# EAGLE design Quadcopter (EAGLE 9.5.2)
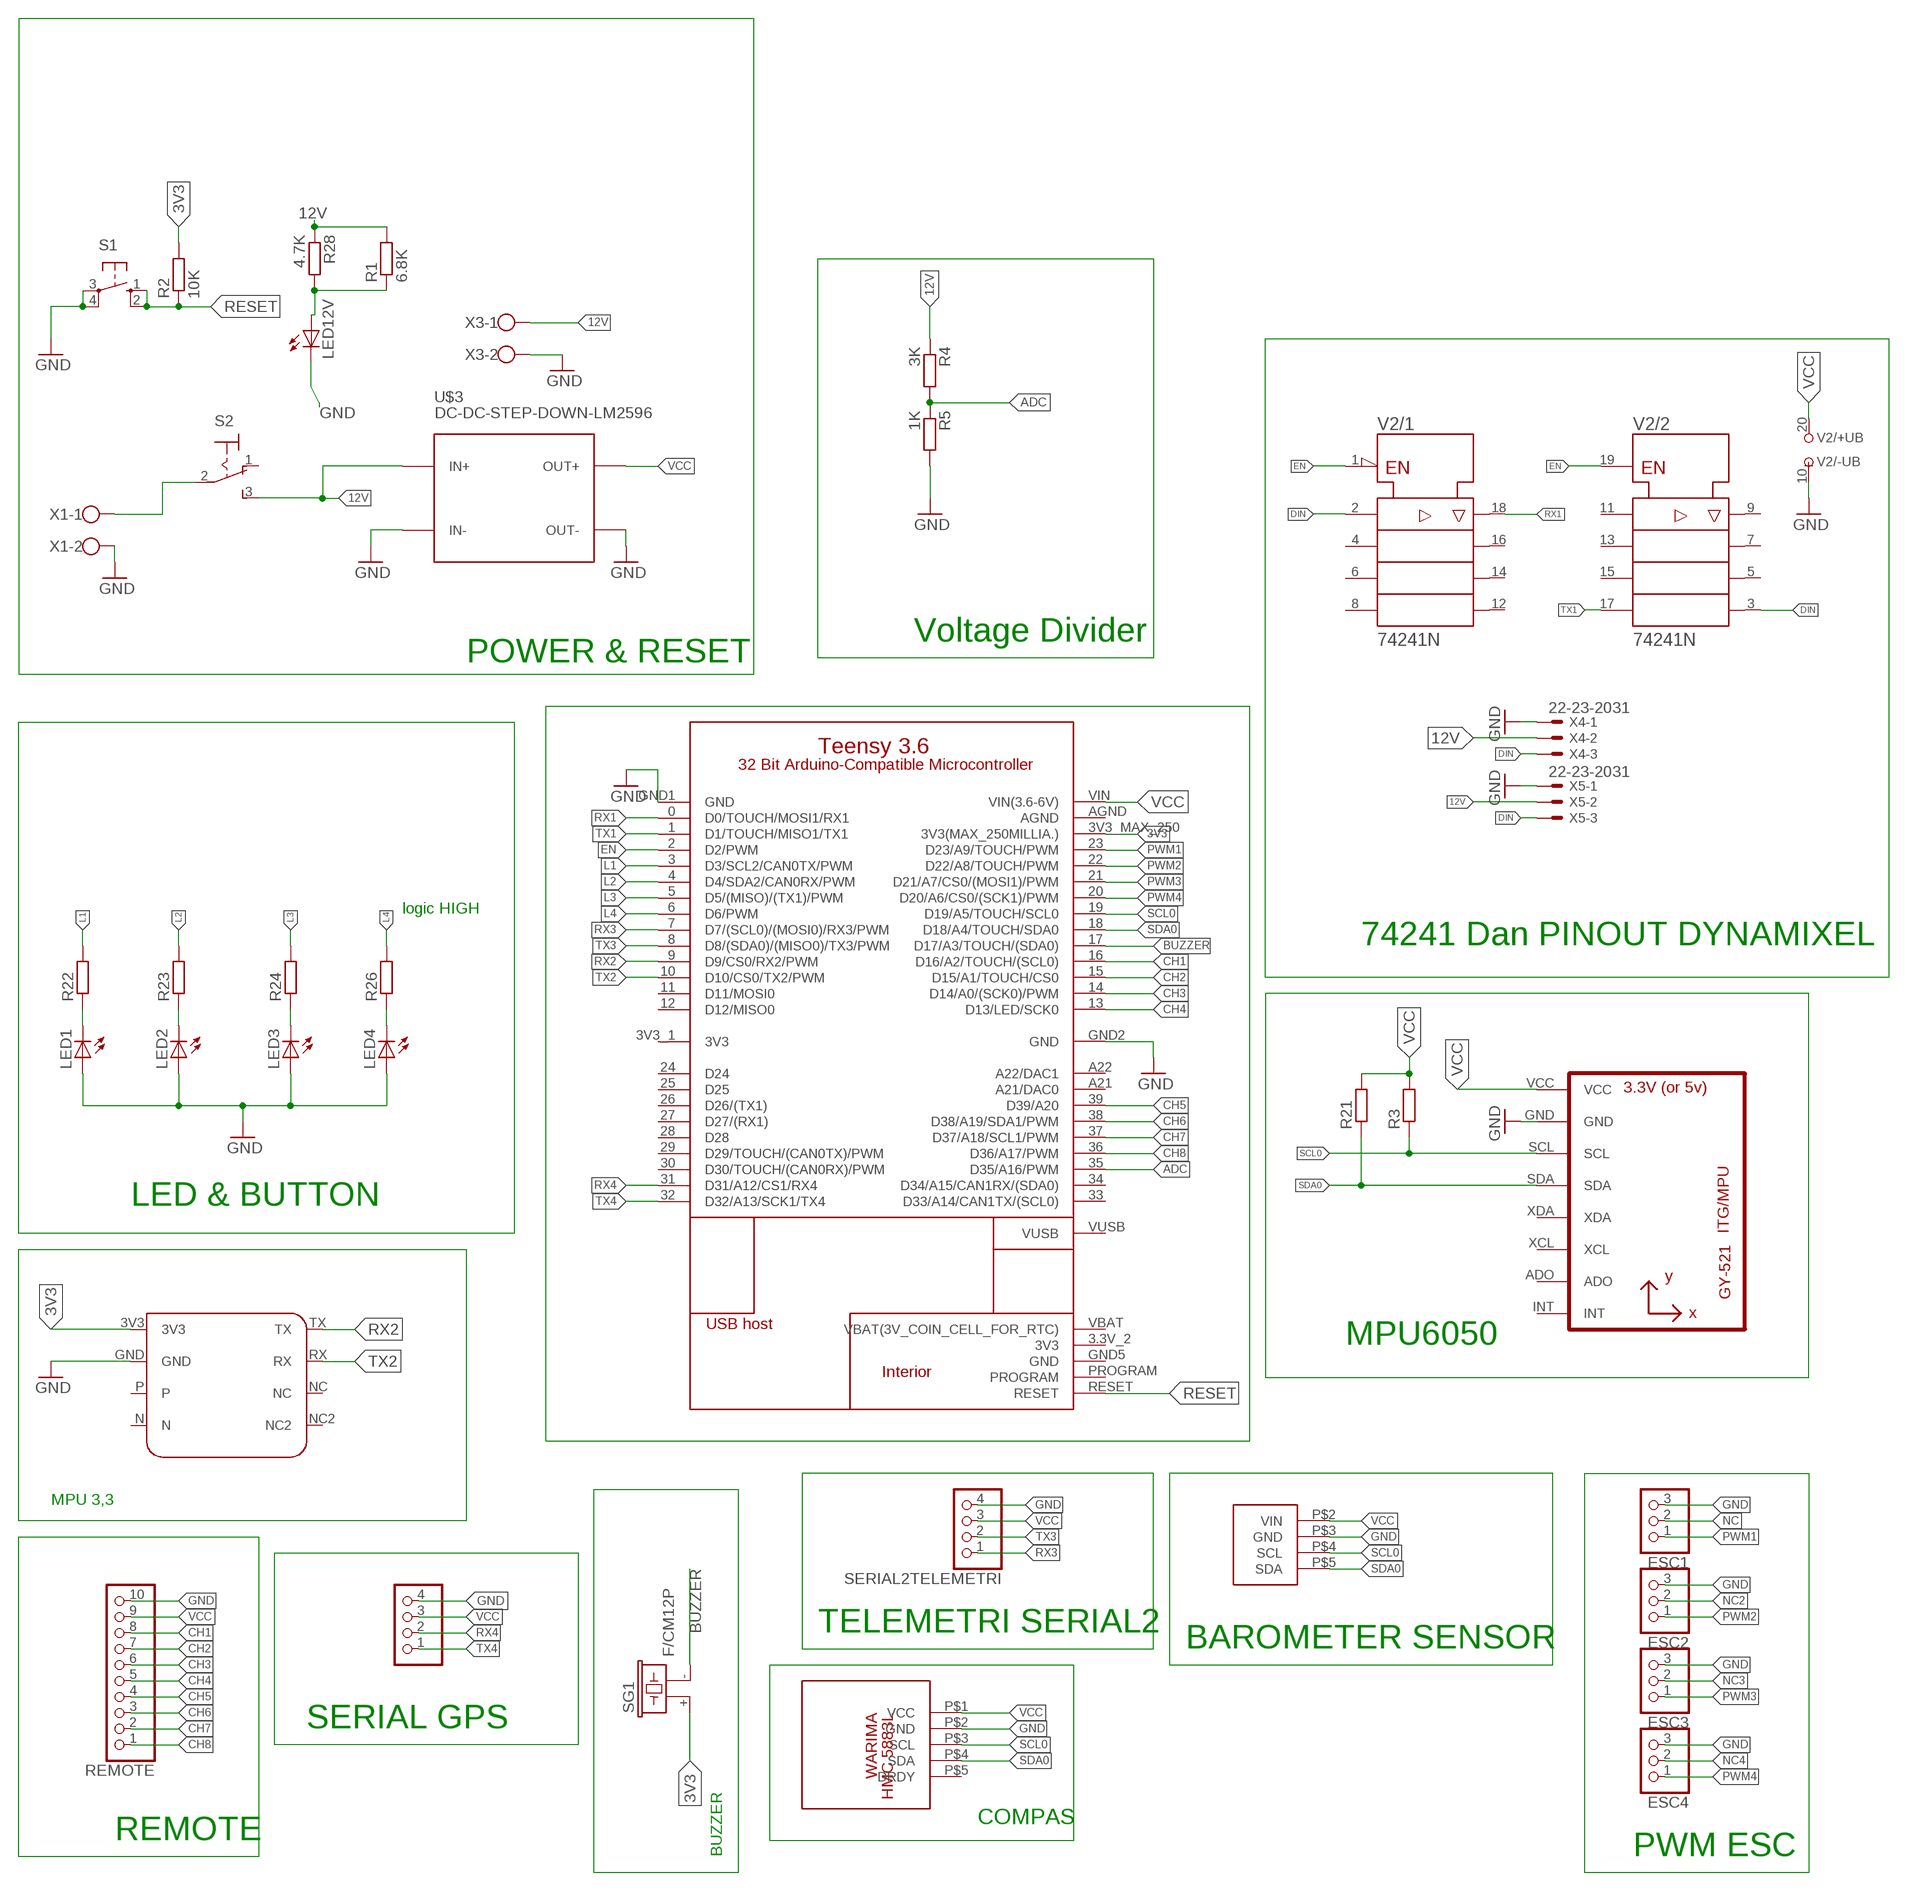
[diagram p0: schematic, sheet 1]

## Parts
ESC1  PINHD-1X3  [1X03]
ESC2  PINHD-1X3  [1X03]
ESC3  PINHD-1X3  [1X03]
ESC4  PINHD-1X3  [1X03]
LED1  LED3MM  [LED3MM]
LED2  LED3MM  [LED3MM]
LED3  LED3MM  [LED3MM]
LED4  LED3MM  [LED3MM]
LED12V  LED3MM  [LED3MM]
R1  6.8K  R-EU_0207/10  [0207/10]
R2  10K  R-EU_0207/10  [0207/10]
R3  R-EU_0207/7  [0207/7]
R4  3K  R-EU_0207/10  [0207/10]
R5  1K  R-EU_0207/10  [0207/10]
R21  R-EU_0207/7  [0207/7]
R22  R-EU_0207/7  [0207/7@1]
R23  R-EU_0207/7  [0207/7@1]
R24  R-EU_0207/7  [0207/7@1]
R26  R-EU_0207/7  [0207/7@1]
R28  4.7K  R-EU_0207/10  [0207/10]
REMOTE  PINHD-1X10  [1X10]
S1  10-XX  [B3F-10XX]
S2  320-916  [320-916]
SERIAL2TELEMETRI  PINHD-1X4  [1X04]
SERIAL2TELEMETRI1  PINHD-1X4  [1X04]
SG1  F/CM12P  [F/CM12P]
U1  GY-521MPU6050  [GY-521]
U$1  TEENSY-3.6_ONLY_HOLES  [TEENSY-3.6_ONLY_HOLES]
U$2  URANUS2  [URANUS2]
U$3  DC-DC-STEP-DOWN-LM2596  [DC-DC-STEP-DOWN-LM2596]
U$4  BMP180  [BMP180]
U$5  HMC588L  [HMC5883L]
V2  74241N  [DIL20]
X1  W237-102  [W237-102]
X3  W237-102  [W237-102]
X4  22-23-2031  [22-23-2031]
X5  22-23-2031  [22-23-2031]

## Nets
3V3: R2.2 SG1.+ U$1.3V3_MAX_250(3V3(MAX_250MILLIA.)) U$2.3V3
12V: R1.2 R4.1 R28.1 S2.3(S) U$3.IN+ X3.1 X4.2 X5.2
ADC: R4.2 R5.1 U$1.35(D35/A16/PWM)
BUZZER: SG1.- U$1.17(D17/A3/TOUCH/(SDA0))
CH1: REMOTE.8 U$1.16(D16/A2/TOUCH/(SCL0))
CH2: REMOTE.7 U$1.15(D15/A1/TOUCH/CS0)
CH3: REMOTE.6 U$1.14(D14/A0/(SCK0)/PWM)
CH4: REMOTE.5 U$1.13(D13/LED/SCK0)
CH5: REMOTE.4 U$1.39(D39/A20)
CH6: REMOTE.3 U$1.38(D38/A19/SDA1/PWM)
CH7: REMOTE.2 U$1.37(D37/A18/SCL1/PWM)
CH8: REMOTE.1 U$1.36(D36/A17/PWM)
DIN: V2.2(/1:A1) V2.3(/2:Y4) X4.3 X5.3
EN: U$1.2(D2/PWM) V2.1(/1:!G) V2.19(/2:G)
GND [pwr]: ESC1.3 ESC2.3 ESC3.3 ESC4.3 LED1.A LED2.A LED3.A LED4.A LED12V.K(C) R5.2 REMOTE.10 S1.3(P) S1.4(P1) SERIAL2TELEMETRI1.4 SERIAL2TELEMETRI.4 U1.GND U$1.GND1(GND) U$1.GND2(GND) U$2.GND U$3.IN- U$3.OUT- U$4.P$3(GND) U$5.P$2(GND) V2.10(/-UB:-UB) X1.2 X3.2 X4.1 X5.1
L1: R22.2 U$1.3(D3/SCL2/CAN0TX/PWM)
L2: R23.2 U$1.4(D4/SDA2/CAN0RX/PWM)
L3: R24.2 U$1.5(D5/(MISO)/(TX1)/PWM)
L4: R26.2 U$1.6(D6/PWM)
N$3: LED1.K(C) R22.1
N$10: S2.2(P) X1.1
N$41: LED2.K(C) R23.1
N$70: LED3.K(C) R24.1
N$71: LED4.K(C) R26.1
N$74: LED12V.A R1.1 R28.2
NC: ESC1.2
NC2: ESC2.2
NC3: ESC3.2
NC4: ESC4.2
PWM1: ESC1.1 U$1.23(D23/A9/TOUCH/PWM)
PWM2: ESC2.1 U$1.22(D22/A8/TOUCH/PWM)
PWM3: ESC3.1 U$1.21(D21/A7/CS0/(MOSI1)/PWM)
PWM4: ESC4.1 U$1.20(D20/A6/CS0/(SCK1)/PWM)
RESET: R2.1 S1.1(S) S1.2(S1) U$1.RESET
RX1: U$1.0(D0/TOUCH/MOSI1/RX1) V2.18(/1:Y1)
RX2: U$1.9(D9/CS0/RX2/PWM) U$2.TX
RX3: SERIAL2TELEMETRI.1 U$1.7(D7/(SCL0)/(MOSI0)/RX3/PWM)
RX4: SERIAL2TELEMETRI1.2 U$1.31(D31/A12/CS1/RX4)
SCL0: R3.1 U1.SCL U$1.19(D19/A5/TOUCH/SCL0) U$4.P$4(SCL) U$5.P$3(SCL)
SDA0: R21.1 U1.SDA U$1.18(D18/A4/TOUCH/SDA0) U$4.P$5(SDA) U$5.P$4(SDA)
TX1: U$1.1(D1/TOUCH/MISO1/TX1) V2.17(/2:A4)
TX2: U$1.10(D10/CS0/TX2/PWM) U$2.RX
TX3: SERIAL2TELEMETRI.2 U$1.8(D8/(SDA0)/(MISO0)/TX3/PWM)
TX4: SERIAL2TELEMETRI1.1 U$1.32(D32/A13/SCK1/TX4)
VCC: R3.2 R21.2 REMOTE.9 SERIAL2TELEMETRI1.3 SERIAL2TELEMETRI.3 U1.VCC U$1.VIN(VIN(3.6-6V)) U$3.OUT+ U$4.P$2(VIN) U$5.P$1(VCC) V2.20(/+UB:+UB)
Unconnected: S2.1(O) U1.ADO U1.INT U1.XCL U1.XDA U$1.3.3V_2(3V3) U$1.11(D11/MOSI0) U$1.12(D12/MISO0) U$1.24(D24) U$1.25(D25) U$1.26(D26/(TX1)) U$1.27(D27/(RX1)) U$1.28(D28) U$1.29(D29/TOUCH/(CAN0TX)/PWM) U$1.30(D30/TOUCH/(CAN0RX)/PWM) U$1.33(D33/A14/CAN1TX/(SCL0)) U$1.34(D34/A15/CAN1RX/(SDA0)) U$1.A21(A21/DAC0) U$1.A22(A22/DAC1) U$1.GND5(GND) U$1.PROGRAM U$1.VBAT(VBAT(3V_COIN_CELL_FOR_RTC)) U$1.VUSB U$2.N U$2.NC U$2.NC2 U$2.P U$5.P$5(DRDY) V2.4(/1:A2) V2.5(/2:Y3) V2.6(/1:A3) V2.7(/2:Y2) V2.8(/1:A4) V2.9(/2:Y1) V2.11(/2:A1) V2.12(/1:Y4) V2.13(/2:A2) V2.14(/1:Y3) V2.15(/2:A3) V2.16(/1:Y2)

## Notes on the sheet
- Voltage Divider
- POWER & RESET
- logic HIGH
- 74241 Dan PINOUT DYNAMIXEL
- LED & BUTTON
- MPU6050
- MPU 3,3
- TELEMETRI SERIAL2
- BAROMETER SENSOR
- SERIAL GPS
- COMPAS
- REMOTE
- BUZZER | PWM ESC

## Power pins joined to a net without a drawn wire
3V3: U$1.3V3_1(3V3)
AGND: U$1.AGND

## Library data of the parts
ESC1-ESC4 = pinhead:PINHD-1X3: PIN HEADER
LED1-LED4 LED12V = led:LED: LED OSRAM: - CHIPLED LG R971, LG N971, LY N971, LG Q971, LY Q971, LO R971, LY R971 LH N974, LH R974 LS Q976, LO Q976, LY Q976 LO Q996 - Hyper CHIPLED LW Q18S LB Q993, LB Q99A, LB R99A - SideLED LS A670, LO A670, LY A670, LG A670, LP A670 LB A673, LV A673, LT A673, LW A673 LH A674 LY A675 LS A676, LA A676, LO A676, LY A676, LW A676 LS A679, LY A679, LG A679 - Hyper Micro SIDELED® LS Y876, LA Y876, LO Y876, LY Y876 LT Y87S - SmartLED LW L88C, LW L88S LB L89C, LB L89S, LG L890 LS L89K, LO L89K, LY L89K LS L896, LA L896, LO L896, LY L896 - TOPLED LS T670, LO T670, LY T670, LG T670, LP T670 LSG T670, LSP T670, LSY T670, LOP T670, LYG T670 LG T671, LOG T671, LSG T671 LB T673, LV T673, LT T673, LW T673 LH T674 LS T676, LA T676, LO T676, LY T676, LB T676, LH T676, LSB T676, LW T676 LB T67C, LV T67C, LT T67C, LS T67K, LO T67K, LY T67K, LW E67C LS E67B, LA E67B, LO E67B, LY E67B, LB E67C, LV E67C, LT E67C LW T67C LS T679, LY T679, LG T679 LS T770, LO T770, LY T770, LG T770, LP T770 LB T773, LV T773, LT T773, LW T773 LH T774 LS E675, LA E675, LY E675, LS T675 LS T776, LA T776, LO T776, LY T776, LB T776 LHGB T686 LT T68C, LB T68C - Hyper Mini TOPLED® LB M676 - Mini TOPLED Santana® LG M470 LS M47K, LO M47K, LY M47K Source: http://www.osram.convergy.de LUXEON: - LUMILED® LXK2-PW12-R00, LXK2-PW12-S00, LXK2-PW14-U00, LXK2-PW14-V00 LXK2-PM12-R00, LXK2-PM12-S00, LXK2-PM14-U00 LXK2-PE12-Q00, LXK2-PE12-R00, LXK2-PE12-S00, LXK2-PE14-T00, LXK2-PE14-U00 LXK2-PB12-K00, LXK2-PB12-L00, LXK2-PB12-M00, LXK2-PB14-N00, LXK2-PB14-P00, LXK2-PB14-Q00 LXK2-PR12-L00, LXK2-PR12-M00, LXK2-PR14-Q00, LXK2-PR14-R00 LXK2-PD12-Q00, LXK2-PD12-R00, LXK2-PD12-S00 LXK2-PH12-R00, LXK2-PH12-S00 LXK2-PL12-P00, LXK2-PL12-Q00, LXK2-PL12-R00 Source: www.luxeon.com KINGBRIGHT: KA-3528ASYC Source: www.kingbright.com
R1-R5 R21 R28 = rcl:R-EU_: RESISTOR, European symbol; SPICEPREFIX: R
R22-R24 R26 = rcl:R-EU_: RESISTOR, European symbol
REMOTE = pinhead:PINHD-1X10: PIN HEADER
S1 = switch-omron:10-XX: OMRON SWITCH; MPN: B3F-1000; OC_FARNELL: 176432; OC_NEWARK: 36M3542
S2 = switch:320-916: TOGGLE SWITCH distributor RS Components
SERIAL2TELEMETRI SERIAL2TELEMETRI1 = pinhead:PINHD-1X4: PIN HEADER
SG1 = buzzer:F/CM12P: BUZZER Source: Buerklin; OC_FARNELL: unknown; OC_NEWARK: unknown
U1 = gy-521:GY-521
U$1 = Teensy-3.6:TEENSY-3.6_ONLY_HOLES
U$2 = custom:URANUS2
U$3 = diy-modules:DC-DC-STEP-DOWN-LM2596: DC/DC Step-Down Regulator based on LM2596-ADJ chip LM2596 datasheet available here: http://www.ti.com/lit/ds/symlink/lm2596.pdf Click here to find device on ebay.com <http://www.ebay.com/sch/lm2596+power+regulator>
U$4 = bmp 180 war:BMP180
U$5 = hmc5883L:HMC588L
V2 = 74ttl-din:74*241: Octal BUFFER and LINE DRIVER, 3-state
X1 X3 = con-wago-500:W237-102: WAGO SCREW CLAMP; MPN: 237-102; OC_FARNELL: unknown; OC_NEWARK: 70K9898
X4 X5 = con-molex:22-23-2031: .100" (2.54mm) Center Header - 3 Pin; MF: MOLEX; MPN: 22-23-2031; OC_FARNELL: 1462950; OC_NEWARK: 30C0862

## Net classes
1 pwr: width 0.4 mm

## Board
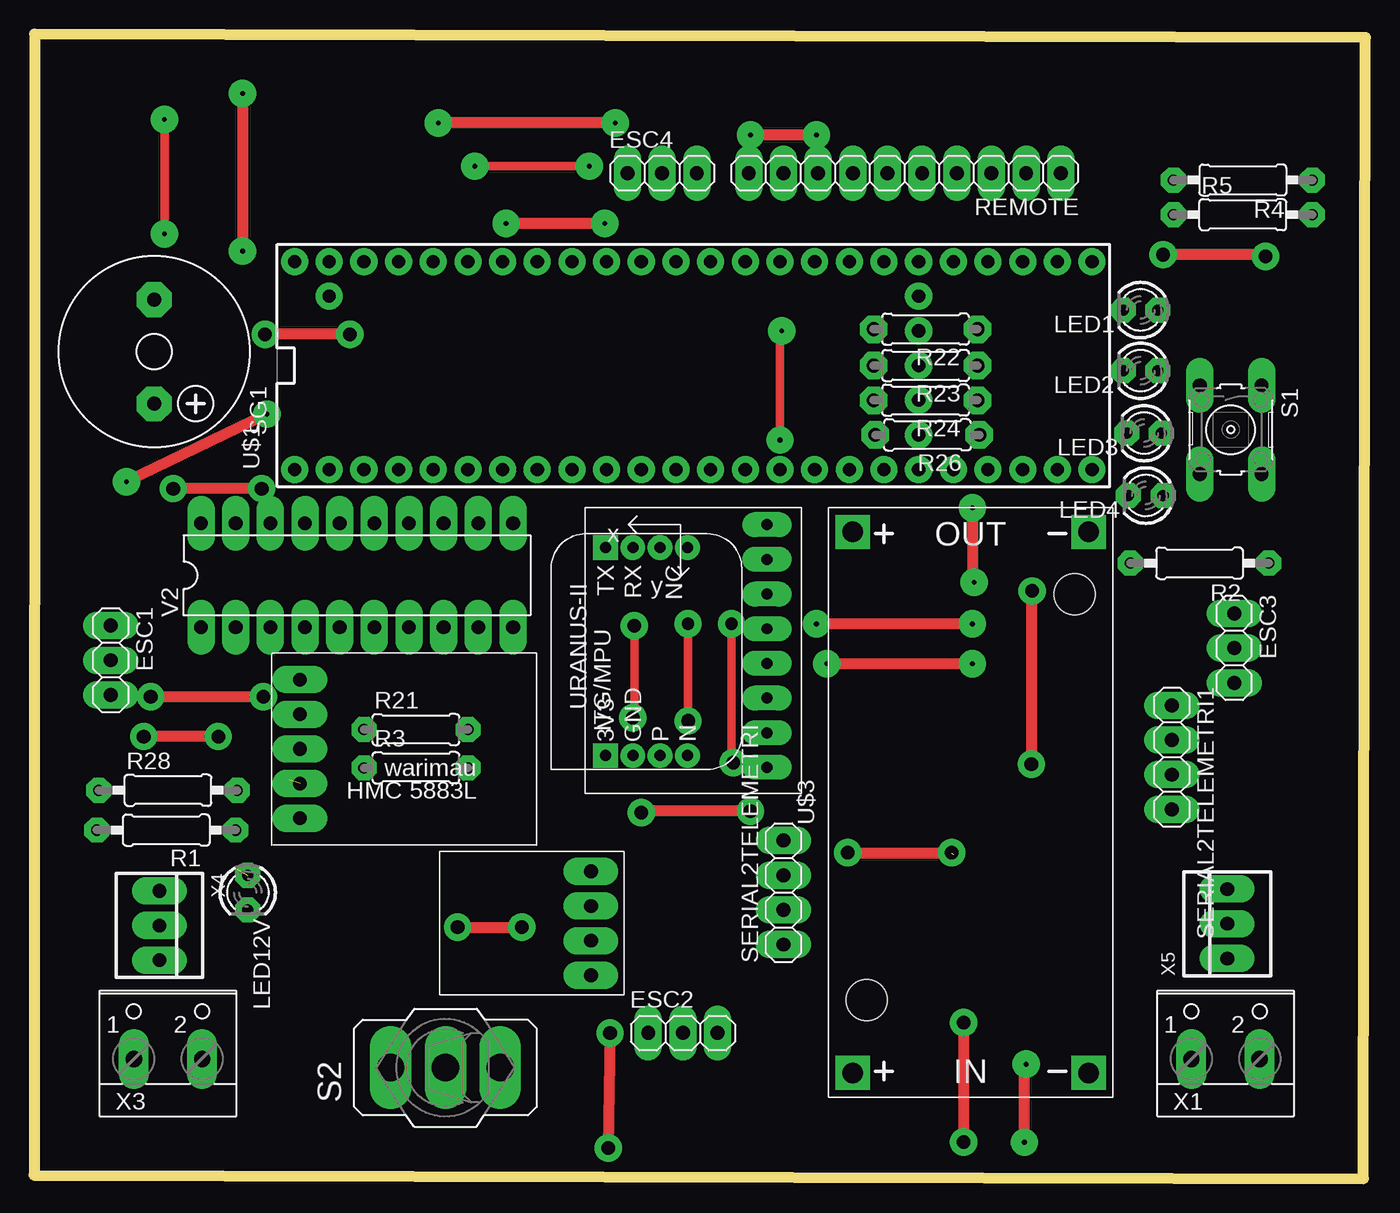
[diagram p1: board, top side]
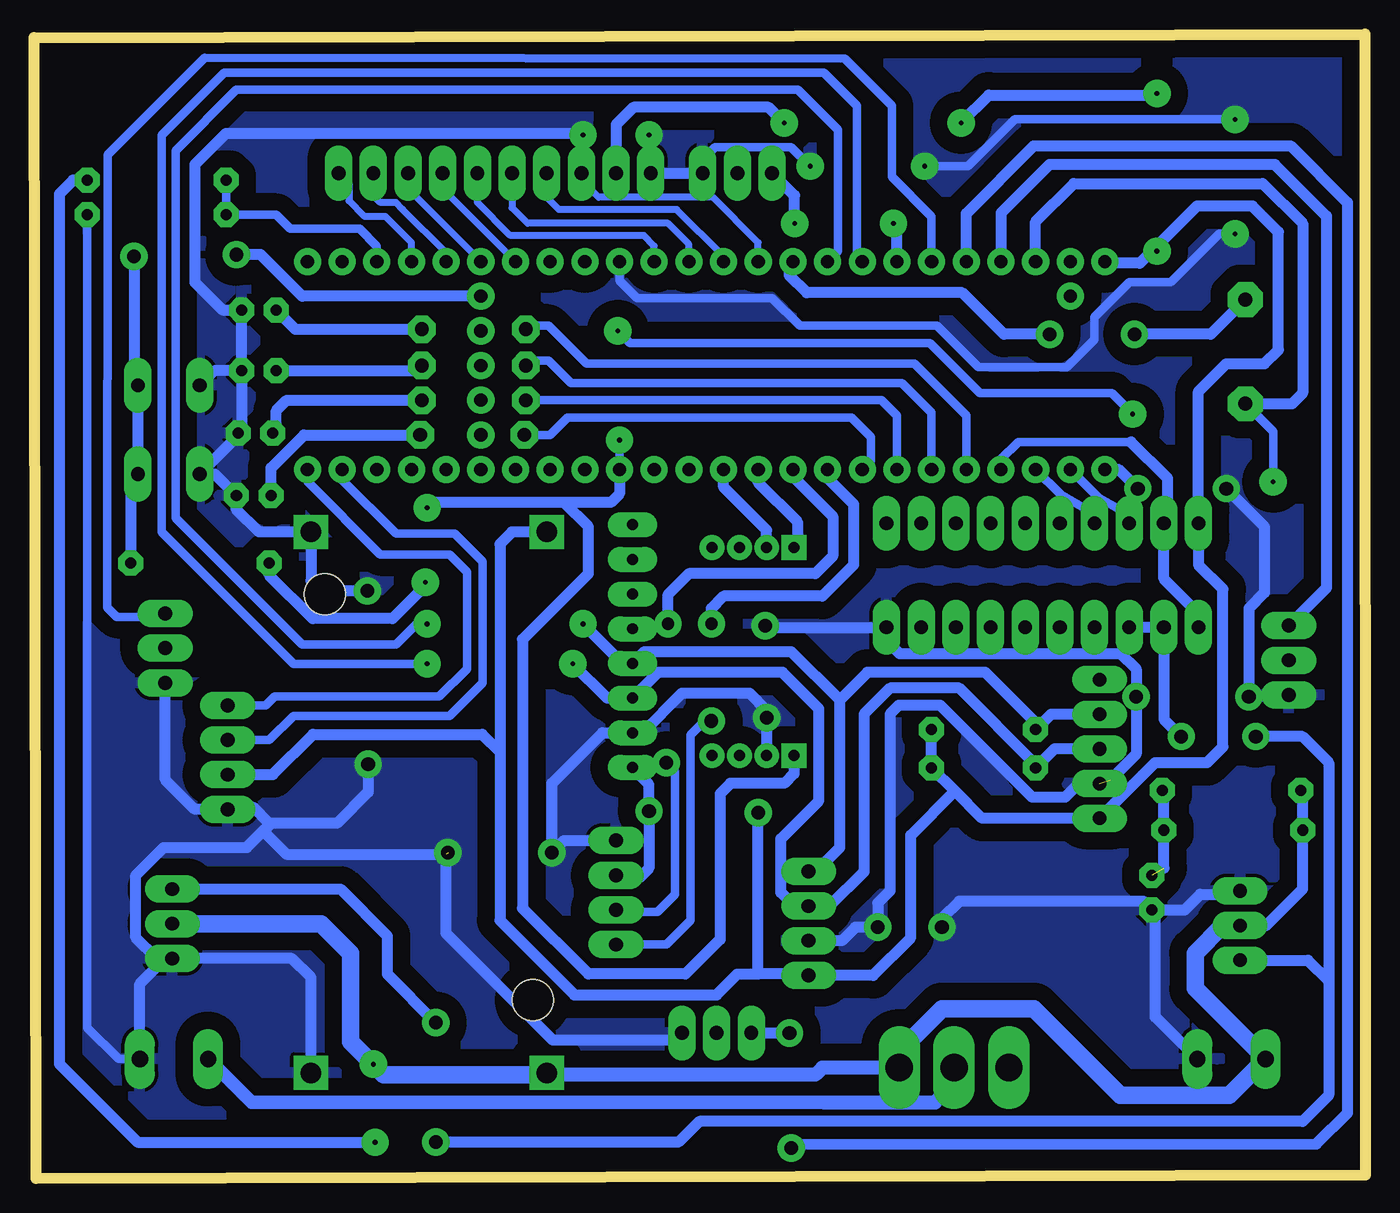
[diagram p2: board, bottom side, seen from below]

Size 97.52 x 83.84 mm. Coordinates in mm from the lower left corner, seen from the top.
Outline: 0,0.25 97.38,0 97.52,83.59 0.03,83.84 0,0.25
Copper layers (1*16): Top 0.035mm / dielectric 1.5mm / Bottom 0.035mm
Design rules "default *": minimum track width 6mil, minimum drill 0.35mm, track to track 6mil, track to pad 6mil, pad to pad 6mil, via to via 6mil, smd to smd 6mil, copper to edge 40mil, drill to drill 6mil, minimum pad ring 20mil, minimum via ring 8mil, stop-mask expansion 4mil, vias tented up to drill 0mil, thermal gap 10mil

### Footprints (pad centres in the part's own frame; a part is rotated, then mirrored left to right if it is on the bottom)
1X03 = drill 1.016 long: 1 -2.54,0; 2 0,0; 3 2.54,0
LED3MM = drill 0.813 octagon: A -1.27,0; K 1.27,0
0207/10 = drill 0.813 octagon: 1 -5.08,0; 2 5.08,0
0207/7 = drill 0.813 octagon: 1 -3.81,0; 2 3.81,0
0207/7@1 = drill 1 octagon: 1 -3.81,0; 2 3.81,0
1X10 = drill 1.016 long: 1 -11.43,0; 2 -8.89,0; 3 -6.35,0; 4 -3.81,0; 5 -1.27,0; 6 1.27,0; 7 3.81,0; 8 6.35,0; 9 8.89,0; 10 11.43,0
B3F-10XX = drill 1.016 long: 1 -3.251,2.261; 2 3.251,2.261; 3 -3.251,-2.261; 4 3.251,-2.261
320-916 = drill 2.007 long: 1 0,4.013; 2 0,0; 3 0,-4.013
1X04 = drill 1.016 long: 1 -3.81,0; 2 -1.27,0; 3 1.27,0; 4 3.81,0
F/CM12P = drill 1.016 pad 2.54 octagon: + 3.81,0; - -3.81,0
GY-521 = drill 0.8 pad 1.778 long: ADO -8.89,-6.35; GND -8.89,6.35; INT -8.89,-8.89; SCL -8.89,3.81; SDA -8.89,1.27; VCC -8.89,8.89; XCL -8.89,-3.81; XDA -8.89,-1.27
TEENSY-3.6_ONLY_HOLES = drill 0.965: 0 -7.62,5.08; 1 -7.62,2.54; 2 -7.62,0; 3 -7.62,-2.54; 3.3V_2 -2.54,-38.1; 3V3_1 -7.62,-27.94; 3V3_MAX_250 7.62,2.54; 4 -7.62,-5.08; 5 -7.62,-7.62; 6 -7.62,-10.16; 7 -7.62,-12.7; 8 -7.62,-15.24; 9 -7.62,-17.78; 10 -7.62,-20.32; 11 -7.62,-22.86; 12 -7.62,-25.4; 13 7.62,-25.4; 14 7.62,-22.86; 15 7.62,-20.32; 16 7.62,-17.78; 17 7.62,-15.24; 18 7.62,-12.7; 19 7.62,-10.16; 20 7.62,-7.62; 21 7.62,-5.08; 22 7.62,-2.54; 23 7.62,0; 24 -7.62,-30.48; 25 -7.62,-33.02; 26 -7.62,-35.56; 27 -7.62,-38.1; 28 -7.62,-40.64; 29 -7.62,-43.18; 30 -7.62,-45.72; 31 -7.62,-48.26; 32 -7.62,-50.8; 33 7.62,-50.8; 34 7.62,-48.26; 35 7.62,-45.72; 36 7.62,-43.18; 37 7.62,-40.64; 38 7.62,-38.1; 39 7.62,-35.56; A21 7.62,-33.02; A22 7.62,-30.48; AGND 7.62,5.08; GND1 -7.62,7.62; GND2 7.62,-27.94; GND5 0,-38.1; PROGRAM 2.54,-38.1; RESET 5.08,-38.1; VBAT -5.08,-38.1; VIN 7.62,7.62; VUSB 5.08,5.08
URANUS2 = drill 0.8 square: 3V3 -8,3; TX 7.24,3 | drill 0.8: GND -8,1; N -8,-3; NC 7.24,-1; NC2 7.24,-3; P -8,-1; RX 7.24,1
DC-DC-STEP-DOWN-LM2596 = drill 1.5 pad 2.5 square: IN+ -19.812,8.636; IN- -19.812,-8.636; OUT+ 19.812,8.636; OUT- 19.812,-8.636 | hole 3: -14.478,7.62; 15.24,-7.62
BMP180 = drill 1 long: P$2 2.412,-1.423; P$3 2.412,-3.963; P$4 2.412,-6.503; P$5 2.412,-9.043
HMC5883L = drill 1 long: P$1 15.477,-0.237; P$2 15.477,-2.777; P$3 15.477,-5.317; P$4 15.477,-7.857; P$5 15.477,-10.397
DIL20 = drill 1 long: 1 -11.43,-3.81; 2 -8.89,-3.81; 3 -6.35,-3.81; 4 -3.81,-3.81; 5 -1.27,-3.81; 6 1.27,-3.81; 7 3.81,-3.81; 8 6.35,-3.81; 9 8.89,-3.81; 10 11.43,-3.81; 11 11.43,3.81; 12 8.89,3.81; 13 6.35,3.81; 14 3.81,3.81; 15 1.27,3.81; 16 -1.27,3.81; 17 -3.81,3.81; 18 -6.35,3.81; 19 -8.89,3.81; 20 -11.43,3.81
W237-102 = drill 1.194 long: 1 -2.5,-1.27; 2 2.5,-1.27
22-23-2031 = drill 1 long: 1 -2.54,0; 2 0,0; 3 2.54,0

### Placement (x,y rotation side)
ESC1  5.62,37.97 270 top
ESC2  47.52,10.67 0 top
ESC3  87.91,38.86 270 top
ESC4  46,73.66 0 top
LED1  81.05,63.63 180 top
LED2  81.05,59.18 180 top
LED3  81.31,54.61 180 top
LED4  81.43,50.04 180 top
LED12V  15.65,20.95 270 top
R1  9.68,25.53 180 top
R2  85.37,45.09 180 top
R3  27.97,30.1 0 top
R4  88.55,73.15 180 top
R5  88.55,70.61 0 top
R21  27.97,32.89 0 top
R22  65.31,62.23 180 top
R23  65.31,59.56 180 top
R24  65.31,57.02 180 top
R26  65.43,54.48 180 top
R28  9.81,28.45 0 top
REMOTE  63.78,73.66 180 top
S1  87.66,54.86 270 top
S2  30.13,8.13 90 top
SERIAL2TELEMETRI  54.89,20.95 90 top
SERIAL2TELEMETRI1  83.34,30.86 270 top
SG1  8.79,60.58 270 top
U1  44.8,39.01 180 top
U$1  26.7,59.56 90 top
U$2  44.86,38.99 90 top
U$3  68.61,27.56 90 top
U$4  43.21,13.46 180 top
U$5  34.95,26.16 180 top
V2  23.65,44.2 0 top
X1  87.28,10.03 0 top
X3  9.81,10.03 0 top
X4  9.17,18.54 270 top
X5  87.4,18.67 90 top

### Tracks (layer width: path | path; a pad name or v marks a point on that pad's centre or on a via)
3V3  (via drill 0.35 pad 2)
  Top 0.61: v54.64,54.1 54.64,61.98 v54.76,62.1
  Top 0.813: v68.73,49.15 68.73,43.82 v68.86,43.69 | v17.05,56.01 6.77,51.07 v6.76,51.05
  Bottom 0.61: U$1.3V3_1 v54.64,54.1 | v54.76,62.1 53.88,61.21 31.9,61.21 28.22,57.53 18.57,57.53 v17.05,56.01 | SG1.+ 6.76,54.74 v6.76,51.05
  Bottom 0.813: 41.94,30.91 U$2.3V3 41.86,29.67 42.57,28.96 46.51,28.96 47.27,28.19 47.27,17.53 49.81,14.99 56.92,14.99 61.75,19.81 61.75,39.5 56.92,44.32 56.92,47.75 58.7,49.53 | U$1.3V3_MAX_250 24.16,70.1 21.36,72.9 7.52,72.9 4.6,69.98 4.6,57.53 5.36,56.77 SG1.+ | v68.86,43.69 68.86,43.43 71.27,41.02 77.12,41.02 80.29,44.2 R2.2 | 58.7,49.53 68.35,49.53 v68.73,49.15 | U$1.3V3_1 54.64,50.16 55.27,49.53 58.7,49.53
12V  (via drill 0.35 pad 2)
  Top 0.813: v72.54,2.67 72.54,8.25 v72.67,8.38
  Bottom 0.813: 59.21,8.38 59.84,7.75 U$3.IN+ 59.84,7.62 | R28.1 4.6,28.32 R1.2 4.6,21.21 7.27,18.54 X4.2 | R4.1 94.66,73.15 95.67,72.14 95.67,8.4 89.94,2.67 v72.54,2.67
  Bottom 1.016: S2.3 39.78,8.13 40.29,7.62 59.84,7.62
  Bottom 1.27: 59.84,7.62 71.91,7.62 v72.67,8.38 74.32,10.03 74.32,16.51 76.48,18.67 X5.2 | X4.2 10.44,18.54 12.47,16.51 12.47,13.93 X3.1 9.97,6.1 17.93,6.1 24.28,12.45 31.02,12.45 34.14,9.32 S2.3
ADC
  Bottom 0.61: U$1.35 72.42,68.33 73.69,69.6 78.77,69.6 79.78,70.61 R5.1 R4.2
BUZZER  (via drill 1 pad 2)
  Top 0.813: v23.14,61.85 v16.92,61.85
  Bottom 0.813: SG1.- 11.33,61.85 v16.92,61.85 | v23.14,61.85 26.48,61.85 29.52,64.9 40.92,64.9 42.19,66.17 42.19,66.93 U$1.17
CH1
  Bottom 0.5: U$1.16 44.48,68.58 47.78,71.88 56.16,71.88 57.43,73.15 REMOTE.8
CH2
  Bottom 0.5: U$1.15 47.02,67.56 50.45,70.99 59.08,70.99 59.97,71.88 REMOTE.7
CH3
  Bottom 0.5: U$1.14 49.56,68.45 51.08,69.98 61.37,69.98 62.51,71.12 REMOTE.6
CH4
  Bottom 0.5: U$1.13 52.1,68.33 52.86,69.09 62.64,69.09 65.05,71.5 REMOTE.5
CH5
  Bottom 0.5: REMOTE.4 67.59,72.52 U$1.39
CH6
  Bottom 0.5: REMOTE.3 70.13,72.52 U$1.38
CH7
  Bottom 0.5: U$1.37 67.34,67.82 70.51,70.99 | 73.18,73.66 REMOTE.2 72.67,72.01 72.16,71.5
  Bottom 0.508: 70.51,70.99 71.02,71.5 72.16,71.5
CH8
  Bottom 0.5: U$1.36 69.88,68.58 71.78,70.48 73.31,70.48 74.45,71.63 74.45,72.9 REMOTE.1
DIN  (via drill 1 pad 2)
  Top 0.813: v13.49,32.38 v8.03,32.38 | v68.1,2.67 68.1,9.65 v68.1,11.43
  Bottom 0.813: V2.3 V2.2 14.76,33.66 v13.49,32.38 13.36,32.51 | v8.03,32.38 4.6,32.38 2.69,30.48 2.69,14.48 | 2.69,14.48 2.69,6.1 4.6,4.19 48.79,4.19 50.32,2.67 v68.1,2.67 68.1,3.05 | X5.3 75.08,21.21 71.66,17.78 71.66,14.99 v68.1,11.43 | 2.69,14.48 4.22,16 X4.3
EN
  Bottom 0.61: 17.17,53.98 25.43,53.98 26.7,52.71 U$1.2
  Bottom 0.813: V2.1 12.22,41.4 14.76,43.94 V2.19 14.5,48.26 14.5,51.31 17.17,53.98
GND  (via drill 0.35 pad 2, 1 pad 2)  (2 unrouted)
  Top 0.61: v43.97,40.51 43.98,40.5 43.98,33.89 v43.86,33.77 | v40.67,74.17 v32.28,74.17 | v9.55,77.6 v9.55,69.22
  Top 0.813: v16.66,50.55 v10.19,50.55 | v8.54,35.31 v16.79,35.31 | v31.02,18.41 v35.71,18.41 | v59.59,23.88 v67.21,23.88 v67.22,23.88 | v73.11,43.05 73.05,42.99 v73.05,30.35 | v57.3,76.45 v52.48,76.45
  Bottom 0.61: 43.84,33.91 v43.86,33.77 | REMOTE.10 52.35,74.8 | v40.67,74.17 42.06,75.56 47.65,75.56 48.54,74.68 ESC4.3 | v9.55,69.22 10.7,69.22 14.25,65.66 17.3,65.66 19.84,63.12 19.84,61.47 21.87,59.44 28.35,59.44 31.4,62.48 41.43,62.48 43.46,64.52 53.37,64.52 54.64,65.79 U$1.GND2 | v32.28,74.17 29.11,74.17 25.68,77.6 v9.55,77.6 | R5.2 93.63,11.05 91.34,8.76 X1.2
  Bottom 0.813: X1.2 89.78,14.26 87.91,16.13 X5.1 | U$3.IN- 77.24,14.73 78.64,16.13 X5.1 | X5.1 88.55,16.13 90.07,17.65 90.07,22.22 88.04,24.26 81.94,24.26 80.8,25.4 | 80.16,26.04 80.8,25.4 | U1.GND 53.56,32.79 | U$4.P$3 38.35,17.43 37.36,18.41 v35.71,18.41 35.71,20.19 34.82,21.08 34.82,34.04 34.19,34.67 31.14,34.67 24.41,27.94 22,27.94 21,28.94 U$5.P$2 | 80.8,25.4 80.67,25.4 79.03,23.75 67.34,23.75 | v16.66,50.55 18.06,51.94 U$1.GND1 | 43.86,30.46 U$2.GND 43.84,31 43.84,33.91 | v43.97,40.51 43.84,40.39 V2.10 35.08,39.43 34.1,38.45 17.9,38.45 16.79,37.34 v16.79,35.31 16.79,31.1 18.7,29.19 | ESC1.3 5.74,35.31 v8.54,35.31 8.54,41.78 7.39,42.93 7.39,47.75 v10.19,50.55 10.06,50.67 | 54.09,32.26 U1.GND | v73.11,43.05 76.48,43.05 77.24,43.82 U$3.OUT- 81.05,47.37 82.7,49.02 LED4.A 84.28,51.61 S1.4 82.58,54.43 LED3.A 82.32,54.86 LED2.A | 67.34,23.75 67.34,17.97 59.53,10.16 50.57,10.16 ESC2.3 | U1.GND 52.96,32.66 50.06,35.56 45.11,35.56 43.86,34.31 v43.86,33.77 | v67.21,23.88 v67.22,23.88 67.34,23.75 | 59.59,24.12 v59.59,23.88 | 59.46,24 v59.59,23.88 | v59.59,23.88 59.59,28.96 55.88,32.66 U1.GND | v73.05,30.35 73.05,28.32 75.34,26.04 80.16,26.04 | LED2.A 84.33,59.18 S1.3 | LED2.A LED1.A 83.72,63.63 85.75,65.66 85.75,74.3 83.47,76.58 57.43,76.58 v57.3,76.45 | 54.76,24.76 SERIAL2TELEMETRI.4 58.7,24.76 v59.59,23.88 | 80.16,26.04 80.29,26.04 81.43,27.18 83.21,27.18 SERIAL2TELEMETRI1.4 85.75,27.05 87.91,29.21 ESC3.3 | LED12V.K 13.23,19.68 12.09,20.83 9.43,20.83 X4.1 | LED12V.K 16.28,20.32 29.75,20.32 31.02,19.05 v31.02,18.41 | ESC4.3 REMOTE.10 52.48,73.79 v52.48,76.45 | X3.2 15.39,11.85 15.39,19.43 LED12V.K
  pour Bottom (isolate 1.27): 0.03,83.82 97.44,83.82 97.44,0 0.03,0
L1
  Bottom 0.61: U$1.3 29.24,55.88 33.05,59.69 57.05,59.69 59.84,62.48 61.88,62.48
  Bottom 0.813: 61.88,62.48 62,62.36 61.88,62.23 R22.2
L2
  Bottom 0.61: U$1.4 31.78,56.13 33.94,58.29 58.19,58.29 59.84,59.94 61.11,59.94
  Bottom 0.813: 61.11,59.94 R23.2
L3
  Bottom 0.61: U$1.5 34.32,55.88 35.46,57.02 R24.2
L4
  Bottom 0.61: U$1.6 36.22,52.58 36.22,54.33 37.65,55.75 58.45,55.75 59.72,54.48 R26.2
N$3
  Bottom 0.813: LED1.K 78.39,62.23 R22.1
N$10
  Bottom 1: X1.1 81.6,5.59 39.65,5.59
  Bottom 1.016: 39.65,5.59 31.52,5.59 30.89,6.22 30.13,6.98 S2.2
N$41
  Bottom 0.813: LED2.K 69.5,59.18 R23.1
N$70
  Bottom 0.813: LED3.K 79.78,54.86 79.78,56.26 79.02,57.02 R24.1
N$71
  Bottom 0.813: LED4.K 80.16,52.07 77.75,54.48 R26.1
N$74  (1 unrouted)
  Bottom 0.813: R28.2 14.76,28.32 R1.1 14.76,22.73
PWM1
  Bottom 0.813: U$1.23 26.7,70.74 23.14,74.3 6.63,74.3 2.85,70.51 2.85,43.28 ESC1.1
PWM2  (via drill 1 pad 2)
  Top 0.813: v42.19,10.67 | v42.06,2.25 v42.06,2.26 v42.19,10.67
  Bottom 0.813: U$1.22 29.24,70.7 24.28,75.65 5.47,75.65 1.32,71.5 1.32,4.8 3.58,2.54 41.81,2.5 v42.06,2.25 | ESC2.1 v42.19,10.67
PWM3
  Bottom 0.61: U$1.21 31.78,70.48 34.7,73.41 34.7,78.61 38.13,82.04 85.03,82.1 92.12,75.02 92.17,42.04 92.17,41.85 91.47,41.15 88.16,41.15 ESC3.1
PWM4  (via drill 0.35 pad 2)
  Top 0.813: v34.57,69.98 v41.81,69.98
  Bottom 0.813: U$1.20 34.32,69.72 v34.57,69.98 | ESC4.1 41.81,72.01 v41.81,69.98
RESET  (via drill 1 pad 2)
  Top 0.813: v90.2,67.56 90.07,67.69 v82.7,67.69
  Bottom 0.813: R2.1 90.45,51.08 S1.2 S1.1 | 89.92,59.08 S1.1 | v90.2,67.56 90.2,58.4 S1.1 | v82.7,67.69 80.93,67.69 77.88,64.64 U$1.RESET
RX1
  Bottom 0.61: U$1.0 19.57,49.89 17.3,48.63 V2.18
RX2
  Bottom 0.813: U$2.TX 41.6,46.48 41.6,48.13 44.48,51.01 U$1.9
RX3  (via drill 0.9 pad 2, 1 pad 2)
  Top 0.61: v47.91,40.64 v47.91,33.53
  Bottom 0.61: SERIAL2TELEMETRI.1 51.21,17.14 49.43,18.92 49.43,32.51 48.41,33.53 v47.91,33.53
  Bottom 0.813: U$1.7 39.27,51.82 39.27,51.18 37.49,49.4 37.49,44.96 39.78,42.67 47.02,42.67 47.91,41.78 v47.91,40.64
RX4
  Bottom 0.61: U$1.31 74.96,51.18 71.02,47.24 66.7,47.24 64.67,45.21 64.67,36.32 67.08,33.91 78.51,33.91 80.29,32.13 SERIAL2TELEMETRI1.2
SCL0  (via drill 0.35 pad 2)
  Top 0.813: v68.73,37.72 v58.07,37.72
  Bottom 0.61: U$1.19 37.24,67.56 37.24,78.61 39.65,81.03 83.59,81.03 88.16,76.45 88.16,47.37 78.51,37.72 v68.73,37.72
  Bottom 0.813: 54.09,34.8 U1.SCL | U$5.P$3 22.78,31.48 R3.1 24.16,30.35 29.75,35.94 34.82,35.94 36.73,34.04 36.73,22.48 39.24,19.96 U$4.P$4 40.9,20.07 41.94,20.07 42.83,20.95 42.83,24.89 40.03,27.69 40.03,34.42 42.7,37.08 51.8,37.08 U1.SCL | U1.SCL 55.55,35.2 v58.07,37.72
SDA0  (via drill 0.35 pad 2)
  Top 0.813: v68.73,40.64 v57.3,40.64
  Bottom 0.61: U$1.18 38.63,67.95 38.63,76.84 41.56,79.76 82.7,79.76 87.15,75.31 87.15,48.39 77.88,39.12 71.02,39.12 69.5,40.64 v68.73,40.64
  Bottom 0.813: U$5.P$4 23.03,34.02 R21.1 24.16,33.4 27.84,37.08 36.48,37.08 38.51,35.05 | 38.51,35.05 38.51,24.26 40.26,22.5 U$4.P$5 | 38.51,35.05 42.06,38.61 52.82,38.61 U1.SDA 54.41,37.74 v57.3,40.64
TX1
  Bottom 0.61: U$1.1 22.32,50.1 19.84,48.68 V2.17
TX2
  Bottom 0.813: U$2.RX 43.86,47.5 47.02,50.66 U$1.10
TX3  (via drill 0.9 pad 2, 1 pad 2)
  Top 0.61: v51.08,40.64 51.08,30.61 v51.21,30.48
  Bottom 0.61: SERIAL2TELEMETRI.2 55.02,19.56 51.84,19.56 50.57,20.83 50.57,29.84 v51.21,30.48
  Bottom 0.813: U$1.8 41.94,51.44 39.02,48.51 39.02,45.59 40.29,44.32 49.56,44.32 51.08,42.8 v51.08,40.64
TX4
  Bottom 0.61: U$1.32 77.5,51.05 72.16,45.72 67.08,45.72 65.81,44.45 65.81,37.34 67.84,35.31 79.91,35.31 80.55,34.67 SERIAL2TELEMETRI1.1
VCC  (via drill 0.35 pad 2, 1 pad 2)
  Top 0.813: v52.48,26.92 44.6,26.92 v44.48,26.8 | v42.57,77.34 v29.62,77.34 | v15.27,79.5 v15.27,67.95
  Bottom 0.61: REMOTE.9 55.14,73.41
  Bottom 0.813: U$4.P$2 41.02,15.11 | U$4.P$2 40.67,15.01 | SERIAL2TELEMETRI.3 54.89,21.97 55.02,22.1 | U$4.P$2 36.07,14.88 33.3,17.65 33.3,25.15 30.06,28.38 | R21.2 R3.2 30.06,28.38 | U$4.P$2 40.9,14.99 44.48,14.99 | 44.48,14.99 v44.48,26.8 | SERIAL2TELEMETRI.3 54.76,22.35 | U1.VCC 53.71,30.1 52.48,28.87 v52.48,26.92 52.48,22.73 53.11,22.1 54.76,22.1 SERIAL2TELEMETRI.3 | 63.4,31.24 63.4,46.48 62.51,47.37 U$3.OUT+ | 63.4,31.24 63.4,18.92 57.94,13.46 47.52,13.46 46,14.99 44.48,14.99 | 30.06,28.38 28.08,26.4 U$5.P$1 15.39,30.48 11.58,30.48 10.44,31.62 10.44,43.18 12.22,44.96 V2.20 12.22,57.66 10.19,59.69 7.39,59.69 6.38,60.71 6.38,69.34 8.28,71.25 12.35,71.25 15.65,67.95 | 83.72,29.97 SERIAL2TELEMETRI1.3 80.04,29.59 77.08,32.55 64.7,32.55 63.4,31.24 | v42.57,77.34 43.71,78.49 53.62,78.49 54.89,77.22 REMOTE.9 | v15.27,67.95 15.65,67.95 | 15.65,67.95 16.54,67.06 18.95,67.06 U$1.VIN | v15.27,79.5 15.39,79.38 27.59,79.38 v29.62,77.34